# EAGLE design PortExpanderCP2130 (EAGLE 7.2.0)
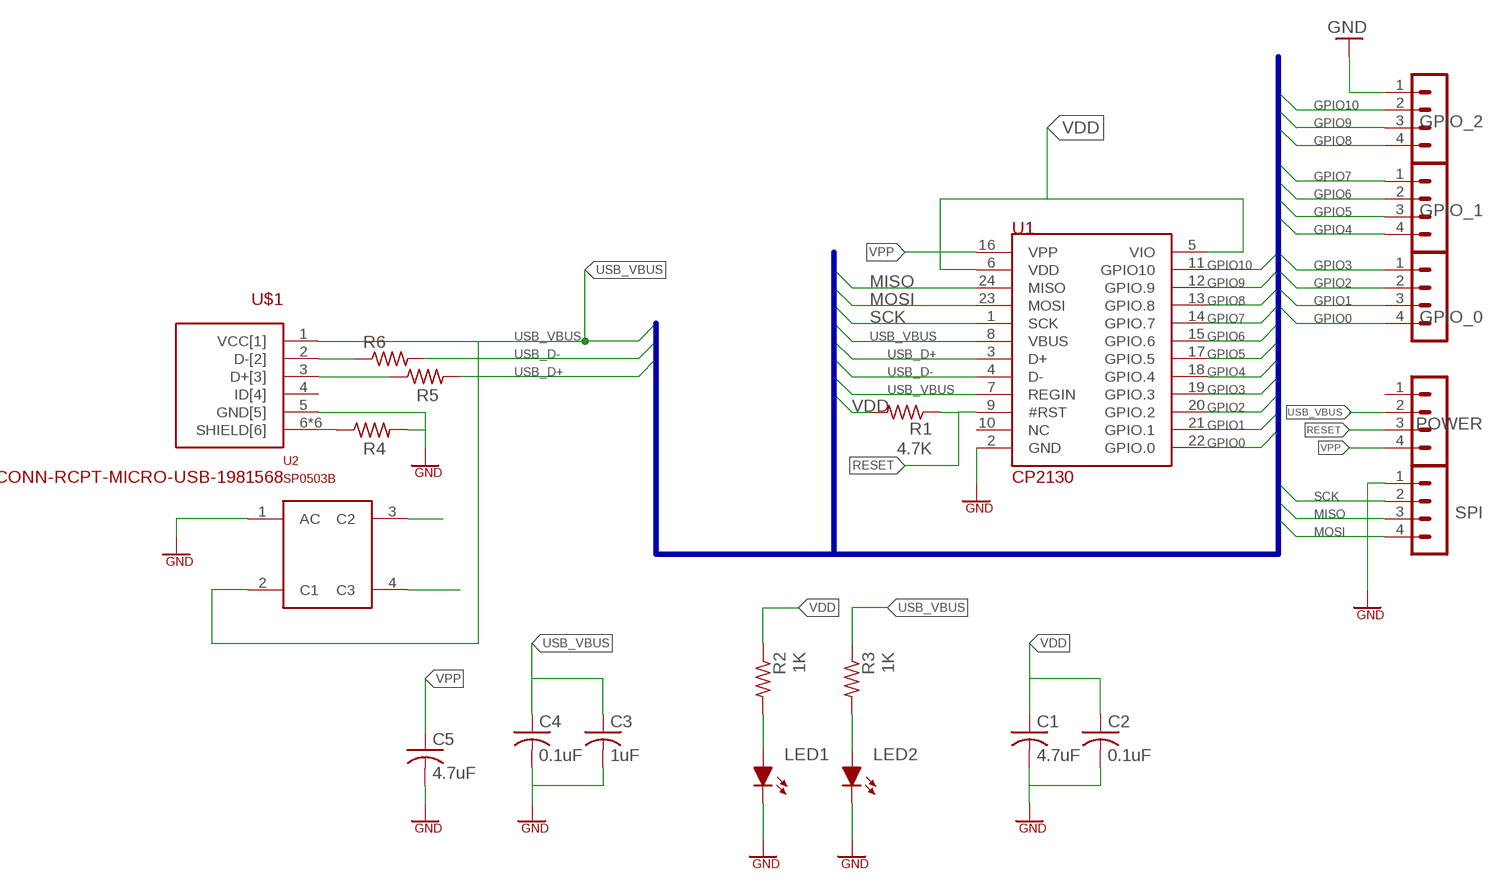
[diagram p0: schematic, sheet 1]

## Parts
C1  4.7uF  C-USC1206  [C1206]
C2  0.1uF  C-USC1206  [C1206]
C3  1uF  C-USC1206  [C1206]
C4  0.1uF  C-USC1206  [C1206]
C5  4.7uF  C-USC1206  [C1206]
GPIO_0  MA04-1  [MA04-1]
GPIO_1  MA04-1  [MA04-1]
GPIO_2  MA04-1  [MA04-1]
LED1  LED_0805  [LED_0805]
LED2  LED_0805  [LED_0805]
POWER  MA04-1  [MA04-1]
R1  4.7K  R-US_R1206  [R1206]
R2  1K  R-US_R1206  [R1206]
R3  1K  R-US_R1206  [R1206]
R4  R-US_R1206  [R1206]
R5  R-US_R1206  [R1206]
R6  R-US_R1206  [R1206]
SPI  MA04-1  [MA04-1]
U1  CP2130  [QFN-24]
U2  SP0503B  SP0503BSOT143  [SOT143]
U$1  CONN-RCPT-MICRO-USB-1981568  [MICRO-USB-RCPT-1981568]

## Nets
GND: C1.2 C2.2 C3.2 C4.2 C5.2 GPIO_2.1 LED1.C LED2.C R4.2 SPI.1 U1.2(GND) U2.1(AC) U$1.5(GND[5])
GPIO0: GPIO_0.4 U1.22(GPIO.0)
GPIO1: GPIO_0.3 U1.21(GPIO.1)
GPIO2: GPIO_0.2 U1.20(GPIO.2)
GPIO3: GPIO_0.1 U1.19(GPIO.3)
GPIO4: GPIO_1.4 U1.18(GPIO.4)
GPIO5: GPIO_1.3 U1.17(GPIO.5)
GPIO6: GPIO_1.2 U1.15(GPIO.6)
GPIO7: GPIO_1.1 U1.14(GPIO.7)
GPIO8: GPIO_2.4 U1.13(GPIO.8)
GPIO9: GPIO_2.3 U1.12(GPIO.9)
GPIO10: GPIO_2.2 U1.11(GPIO10)
MISO: SPI.3 U1.24(MISO)
MOSI: SPI.4 U1.23(MOSI)
N$1: R4.1 U$1.6(SHIELD[6]) U$1.7(SHIELD[6]) U$1.8(SHIELD[6]) U$1.9(SHIELD[6]) U$1.10(SHIELD[6]) U$1.11(SHIELD[6])
N$2: R6.1 U$1.2(D-[2])
N$3: R5.1 U$1.3(D+[3])
N$4: LED2.A R3.2
N$5: LED1.A R2.2
N$6: U2.3(C2)
N$7: U2.4(C3)
RESET: POWER.3 R1.1 U1.9(#RST)
SCK: SPI.2 U1.1(SCK)
USB_D+: R5.2 U1.3(D+)
USB_D-: R6.2 U1.4(D-)
USB_VBUS: C3.1 C4.1 POWER.2 R3.1 U1.7(REGIN) U1.8(VBUS) U2.2(C1) U$1.1(VCC[1])
VDD: C1.1 C2.1 R1.2 R2.1 U1.5(VIO) U1.6(VDD)
VPP: C5.1 POWER.4 U1.16(VPP)
Unconnected: POWER.1 U1.10(NC) U$1.4(ID[4])

## Buses
USB_VBUS,USB_D-,USB_D+,VDD,VIO,MISO,MOSI,GPIO[0..10],SCK,VDD

## Library data of the parts
C1-C5 = rcl:C-US: CAPACITOR, American symbol
GPIO_0 GPIO_1 GPIO_2 POWER SPI = con-lstb:MA04-1: PIN HEADER; OC_FARNELL: unknown; OC_NEWARK: unknown
LED1 LED2 = eagle-book:LED: Light Emitting Diode
R1-R6 = resistor:R-US_: RESISTOR, American symbol
U1 = ExarLib:CP2130
U2 = HCloudLib:SP0503B
U$1 = HCloudLib:CONN-RCPT-MICRO-USB-1981568

## Net classes
0 default: width 0.152 mm
1 USB_VBUS: width 0.254 mm
2 GND: width 0.508 mm, clearance 0.127 mm

## Board
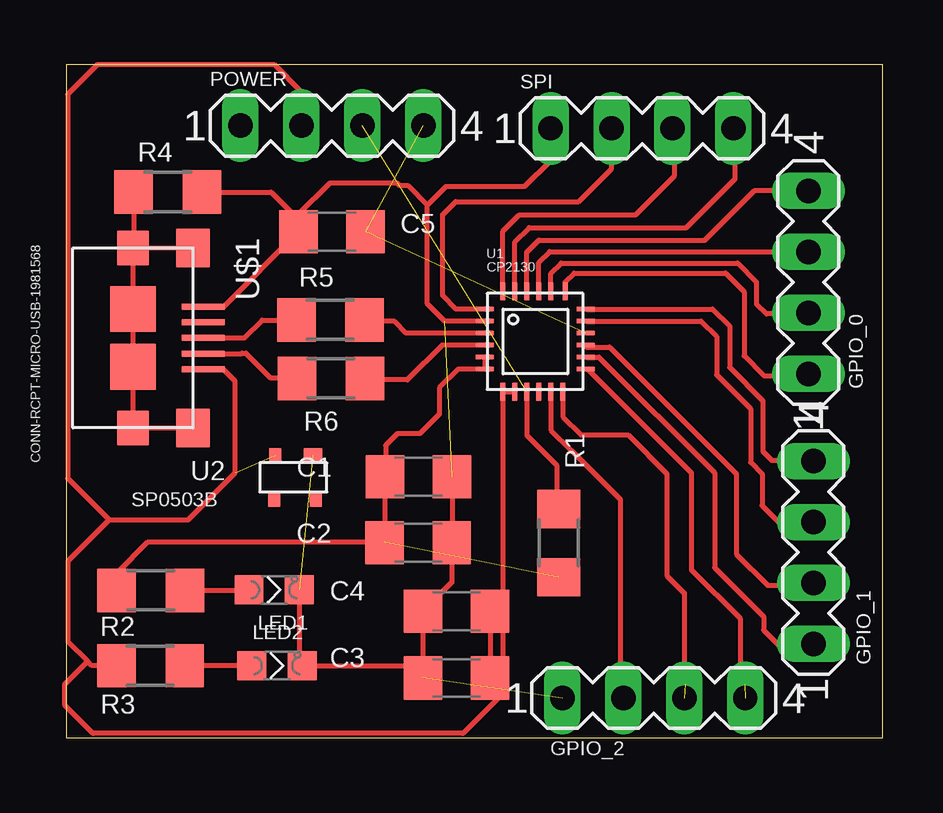
[diagram p1: board, top side]

Size 34.02 x 28.05 mm. Coordinates in mm from the lower left corner, seen from the top.
Outline: 0,0 34.02,0 34.02,28.05 0,28.05 0,0
Copper layers (1*16): Top 0.035mm / dielectric 1.5mm / Bottom 0.035mm
Design rules "default": minimum track width 10mil, minimum drill 24mil, track to track 8mil, track to pad 8mil, pad to pad 8mil, via to via 8mil, smd to smd 8mil, copper to edge 40mil, drill to drill 8mil, minimum pad ring 10mil, minimum via ring 8mil, stop-mask expansion 4mil, vias tented up to drill 0mil, thermal gap 10mil

### Footprints (pad centres in the part's own frame; a part is rotated, then mirrored left to right if it is on the bottom)
C1206 = smd 1.6 x 1.8: 1 -1.4,0; 2 1.4,0
MA04-1 = drill 1.016 long: 1 -3.81,0; 2 -1.27,0; 3 1.27,0; 4 3.81,0
LED_0805 = smd 1.2 x 1.2: A 0,-1.05; C 0,1.05
R1206 = smd 1.6 x 1.803: 1 -1.422,0; 2 1.422,0
QFN-24 = smd 0.75 x 0.2: 1 -2.1,1.35; 2 -2.1,0.85; 3 -2.1,0.35; 4 -2.1,-0.15; 5 -2.1,-0.65; 6 -2.1,-1.15; 13 2.1,-1.15; 14 2.1,-0.65; 15 2.1,-0.15; 16 2.1,0.35; 17 2.1,0.85; 18 2.1,1.35 | smd 0.2 x 0.75: 7 -1.35,-2.1; 8 -0.85,-2.1; 9 -0.35,-2.1; 10 0.15,-2.1; 11 0.65,-2.1; 12 1.15,-2.1; 19 1.25,2.1; 20 0.65,2.1; 21 0.15,2.1; 22 -0.35,2.1; 23 -0.85,2.1; 24 -1.35,2.1
SOT143 = smd 0.76 x 0.55: 1 -0.82,-0.93 | smd 0.5 x 0.55: 2 0.76,-0.93; 3 0.79,0.94; 4 -0.94,0.94
MICRO-USB-RCPT-1981568 = smd 0.25 x 1.8: 1 1.3,2.93; 2 0.65,2.93; 3 0,2.93; 4 -0.65,2.93; 5 -1.3,2.93 | smd 1.6 x 1.4: 6 -3.75,2.5; 11 3.75,2.5 | smd 1.45 x 1.3: 7 -3.75,0; 10 3.75,0 | smd 1.9 x 1.9: 8 -1.2,0; 9 1.2,0

### Placement (x,y rotation side)
C1  14.67,10.88 0 top
C2  14.66,8.13 0 top
C3  16.26,2.49 180 top
C4  16.26,5.27 180 top
C5  11.08,21.08 180 top
GPIO_0  30.92,18.97 90 top
GPIO_1  31.13,7.72 90 top
GPIO_2  24.48,1.66 0 top
LED1  8.66,6.16 270 top
LED2  8.78,3 270 top
POWER  11.07,25.5 0 top
R1  20.52,8.11 270 top
R2  3.52,6.14 0 top
R3  3.51,3 0 top
R4  4.23,22.74 0 top
R5  11.01,17.41 0 top
R6  11.03,14.97 0 top
SPI  23.99,25.39 0 top
U1  19.54,16.51 0 top
U2  9.46,10.85 180 top
U$1  2.78,16.66 270 top

### Tracks (layer width: path | path; a pad name or v marks a point on that pad's centre or on a via)
GND  (3 unrouted)
  Top 0.2: U1.2 15.77,17.36 15.05,18.08 15.05,22.19 | 15.05,22.19 15.83,22.97 19.1,22.97 20.18,24.05 SPI.1 | C1.2 16.07,8.14 C2.2 16.06,6.47 C4.2 C3.2 14.35,3 LED2.C 9.71,3.12 LED1.C | U$1.5 6.55,17.96 C5.2 9.68,21.6 | 9.68,21.6 9.68,21.81 10.99,23.12 13.78,23.12 13.88,23.02 14.22,23.02 15.05,22.19 | R4.2 8.54,22.74 9.68,21.6
GPIO0
  Top 0.2: U1.22 19.19,20.23 19.69,20.73 26.61,20.73 28.66,22.78 GPIO_0.4
GPIO1
  Top 0.2: U1.21 19.69,19.81 20.14,20.26 30.9,20.26 GPIO_0.3
GPIO2
  Top 0.2: U1.20 20.19,19.35 20.62,19.78 27.97,19.78 28.76,18.99 28.76,18.08 29.18,17.66 30.82,17.66 30.86,17.7 GPIO_0.2
GPIO3
  Top 0.2: U1.19 20.79,18.99 21.16,19.36 27.47,19.36 28.25,18.58 28.25,15.91 29.07,15.09 30.85,15.09 GPIO_0.1
GPIO4
  Top 0.2: U1.18 26.94,17.86 27.64,17.16 27.64,15.43 29.03,14.04 29.03,11.93 29.4,11.56 31.1,11.56 GPIO_1.4
GPIO5
  Top 0.2: U1.17 26.46,17.36 27.1,16.72 27.1,15.12 28.52,13.7 28.52,11.47 29,10.99 29,9.67 29.68,8.99 GPIO_1.3
GPIO6
  Top 0.2: U1.15 21.64,16.31 21.67,16.28 22.64,16.28 27.92,11 27.92,7.65 29.22,6.35 31.03,6.35 GPIO_1.2
GPIO7
  Top 0.2: U1.14 22.2,15.86 27.02,11.04 27.02,7.09 29.06,5.05 29.06,4.48 29.71,3.83 31.05,3.83 GPIO_1.1
GPIO8  (1 unrouted)
  Top 0.2: U1.13 21.73,15.36 26.05,11.04 26.05,7 28.08,4.97 28.08,2.44 28.28,2.24
GPIO9  (1 unrouted)
  Top 0.2: U1.12 20.69,13.38 21.45,12.62 23.41,12.62 25.03,11 25.03,6.76 25.76,6.03 25.76,2.28 25.8,2.24
GPIO10
  Top 0.2: U1.11 20.19,12.82 21.04,11.97 21.05,11.97 23.08,9.94 23.08,2.53 23.03,2.48 23.03,1.84 GPIO_2.2
MISO
  Top 0.2: U1.24 18.19,21.1 18.88,21.79 23.72,21.79 25.35,23.42 25.35,25.3 SPI.3
MOSI
  Top 0.2: U1.23 18.69,20.66 19.29,21.26 25.84,21.26 27.87,23.29 27.87,25.32 SPI.4
N$1
  Top 0.2: R4.1 2.81,20.44 U$1.7 | U$1.7 U$1.6 | U$1.7 U$1.8 U$1.9 U$1.10 U$1.11
N$2
  Top 0.2: U$1.2 7.31,16.01 7.33,16.03 7.48,16.03 8.5,15.01 9.57,15.01 R6.1
N$3
  Top 0.2: U$1.3 7.42,16.66 8.16,17.4 9.58,17.4 R5.1
N$4
  Top 0.2: LED2.A R3.2
N$5
  Top 0.2: R2.2 7.59,6.14 LED1.A
RESET  (1 unrouted)
  Top 0.2: U1.9 19.19,12.6 20.43,11.36 20.43,9.62 R1.1
SCK
  Top 0.2: U1.1 16.25,17.86 15.68,18.43 15.68,21.8 16.22,22.34 21.35,22.34 22.72,23.71 SPI.2
USB_D+
  Top 0.2: U1.3 14.17,16.86 13.68,17.35 12.49,17.35 R5.2
USB_D-
  Top 0.2: U1.4 15.66,16.36 14.21,14.91 12.51,14.91 R6.2
USB_VBUS  (1 unrouted)
  Top 0.2: U1.7 U1.8 | U1.7 18.19,5.8 C4.1 C3.1 | R3.1 1.07,3 0.89,3.18 | 0.89,3.18 0.08,3.99 0.08,7.37 1.79,9.08 | 1.79,9.08 5.08,9.08 7.04,11.04 7.04,14.86 6.55,15.35 U$1.1 | POWER.2 9.8,26.92 8.68,28.04 1.29,28.04 0.06,26.81 0.06,10.81 1.79,9.08 | U1.7 18.19,1.83 16.54,0.18 1.11,0.18 -0.06,1.35 -0.06,2.23 0.89,3.18
VDD  (1 unrouted)
  Top 0.2: 13.27,8.14 C1.1 13.31,10.92 13.31,12.18 13.8,12.67 14.73,12.67 15.55,13.49 15.55,14.58 16.33,15.36 U1.6 U1.5 | 13.27,8.14 C2.1 | 13.27,8.14 3.38,8.14 2.12,6.88 2.12,6.16 R2.1
VPP  (2 unrouted)